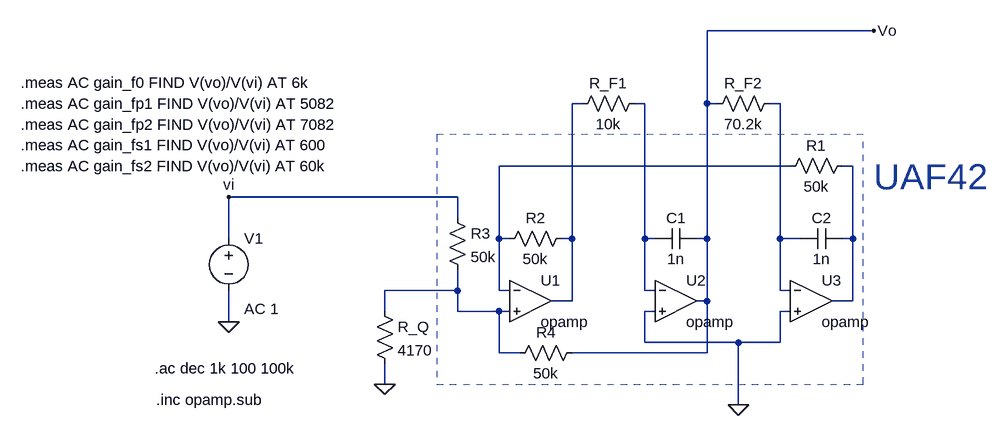
[diagram p0: schematic sim.asc]
sim.asc, the LTspice schematic file:
Version 4
SHEET 1 880 680
WIRE 576 -256 320 -256
WIRE 128 -144 112 -144
WIRE 224 -144 208 -144
WIRE 320 -144 320 -256
WIRE 336 -144 320 -144
WIRE 432 -144 416 -144
WIRE 448 -48 0 -48
WIRE 544 -48 528 -48
WIRE -64 0 -416 0
WIRE -64 32 -64 0
WIRE -416 64 -416 0
WIRE 0 64 0 -48
WIRE 16 64 0 64
WIRE 112 64 112 -144
WIRE 112 64 96 64
WIRE 224 64 224 -144
WIRE 240 64 224 64
WIRE 320 64 320 -144
WIRE 320 64 304 64
WIRE 432 64 432 -144
WIRE 464 64 432 64
WIRE 544 64 544 -48
WIRE 544 64 528 64
WIRE -64 144 -64 112
WIRE -64 144 -176 144
WIRE 0 144 0 64
WIRE 16 144 0 144
WIRE 224 144 224 64
WIRE 240 144 224 144
WIRE 432 144 432 64
WIRE 448 144 432 144
WIRE 112 160 112 64
WIRE 112 160 80 160
WIRE 320 160 320 64
WIRE 320 160 304 160
WIRE 544 160 544 64
WIRE 544 160 512 160
WIRE -176 176 -176 144
WIRE -64 176 -64 144
WIRE 0 176 -64 176
WIRE 16 176 0 176
WIRE 240 176 224 176
WIRE 448 176 432 176
WIRE -416 192 -416 144
WIRE 224 224 224 176
WIRE 368 224 224 224
WIRE 432 224 432 176
WIRE 432 224 368 224
WIRE 0 240 0 176
WIRE 32 240 0 240
WIRE 320 240 320 160
WIRE 320 240 112 240
WIRE -176 288 -176 256
WIRE 368 320 368 224
FLAG -416 192 0
FLAG 368 320 0
FLAG 576 -256 Vo
FLAG -176 288 0
FLAG -416 0 vi
SYMBOL OpAmps\\opamp 48 96 R0
SYMATTR InstName U1
SYMATTR SpiceLine2 GBW=10G
SYMBOL OpAmps\\opamp 272 96 R0
SYMATTR InstName U2
SYMATTR SpiceLine2 GBW=10G
SYMBOL OpAmps\\opamp 480 96 R0
SYMATTR InstName U3
SYMATTR SpiceLine2 GBW=10G
SYMBOL cap 304 48 R90
WINDOW 0 0 32 VBottom 2
WINDOW 3 32 32 VTop 2
SYMATTR InstName C1
SYMATTR Value 1n
SYMBOL cap 528 48 R90
WINDOW 0 0 32 VBottom 2
WINDOW 3 32 32 VTop 2
SYMATTR InstName C2
SYMATTR Value 1n
SYMBOL res 128 224 R90
WINDOW 0 0 56 VBottom 2
WINDOW 3 32 56 VTop 2
SYMATTR InstName R4
SYMATTR Value 50k
SYMBOL res 112 48 R90
WINDOW 0 0 56 VBottom 2
WINDOW 3 32 56 VTop 2
SYMATTR InstName R2
SYMATTR Value 50k
SYMBOL res 224 -160 R90
WINDOW 0 0 56 VBottom 2
WINDOW 3 32 56 VTop 2
SYMATTR InstName R_F1
SYMATTR Value 10k
SYMBOL res 432 -160 R90
WINDOW 0 0 56 VBottom 2
WINDOW 3 32 56 VTop 2
SYMATTR InstName R_F2
SYMATTR Value 70.2k
SYMBOL res 544 -64 R90
WINDOW 0 0 56 VBottom 2
WINDOW 3 32 56 VTop 2
SYMATTR InstName R1
SYMATTR Value 50k
SYMBOL res -80 16 R0
SYMATTR InstName R3
SYMATTR Value 50k
SYMBOL voltage -416 48 R0
WINDOW 123 24 124 Left 2
WINDOW 39 0 0 Left 0
SYMATTR InstName V1
SYMATTR Value ""
SYMATTR Value2 AC 1
SYMBOL res -192 160 R0
SYMATTR InstName R_Q
SYMATTR Value 4170
TEXT -528 312 Left 2 !.inc opamp.sub
TEXT -530 264 Left 2 !.ac dec 1k 100 100k
TEXT 576 -32 Left 5 ;UAF42
TEXT -736 -176 Left 2 !.meas AC gain_f0 FIND V(vo)/V(vi) AT 6k
TEXT -736 -144 Left 2 !.meas AC gain_fp1 FIND V(vo)/V(vi) AT 5082
TEXT -736 -112 Left 2 !.meas AC gain_fp2 FIND V(vo)/V(vi) AT 7082
TEXT -736 -80 Left 2 !.meas AC gain_fs1 FIND V(vo)/V(vi) AT 600
TEXT -736 -48 Left 2 !.meas AC gain_fs2 FIND V(vo)/V(vi) AT 60k
RECTANGLE Normal 560 -96 -96 288 1

The netlist it stands for:
* sim.asc
XU1 N004 N006 N001 opamp Aol=100K GBW=10G  ; pins invin noninvin out
XU2 N002 0 Vo opamp Aol=100K GBW=10G  ; pins invin noninvin out
XU3 N003 0 N005 opamp Aol=100K GBW=10G  ; pins invin noninvin out
C1 Vo N002 1n
C2 N005 N003 1n
R4 Vo N006 50k
R2 N001 N004 50k
R_F1 N002 N001 10k
R_F2 N003 Vo 70.2k
R1 N005 N004 50k
R3 vi N006 50k
V1 vi 0 AC 1
R_Q N006 0 4170
.inc opamp.sub
.ac dec 1k 100 100k
* UAF42
.meas AC gain_f0 FIND V(vo)/V(vi) AT 6k
.meas AC gain_fp1 FIND V(vo)/V(vi) AT 5082
.meas AC gain_fp2 FIND V(vo)/V(vi) AT 7082
.meas AC gain_fs1 FIND V(vo)/V(vi) AT 600
.meas AC gain_fs2 FIND V(vo)/V(vi) AT 60k
.backanno
.end